# Altium schematic sheet node MCU.SchDoc
size A; SheetNumber: 1; SheetTotal: 1
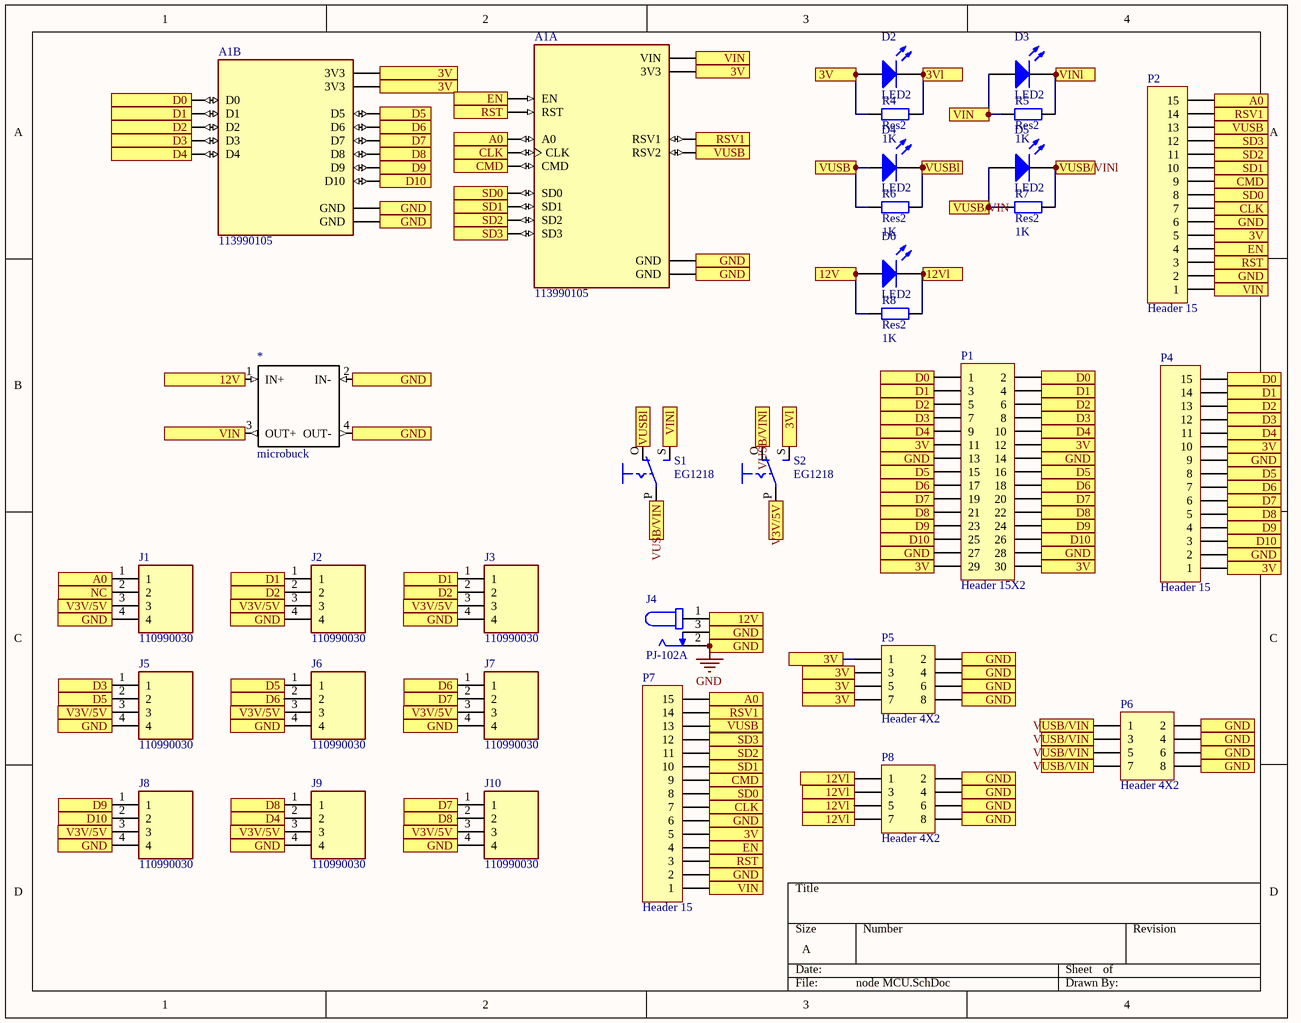
[diagram p0: node MCU.SchDoc]

## Parts
*  microbuck  [Micro buck]
A1  113990105  [SEEED_113990105]  (parts A,B of 2)
D2  LED2  [3.2X1.6X1.1]
D3  LED2  [3.2X1.6X1.1]
D4  LED2  [3.2X1.6X1.1]
D5  LED2  [3.2X1.6X1.1]
D6  LED2  [3.2X1.6X1.1]
J1  110990030  [SEEED_110990030]
J2  110990030  [SEEED_110990030]
J3  110990030  [SEEED_110990030]
J4  PJ-102A  [CUI_PJ-102A]
J5  110990030  [SEEED_110990030]
J6  110990030  [SEEED_110990030]
J7  110990030  [SEEED_110990030]
J8  110990030  [SEEED_110990030]
J9  110990030  [SEEED_110990030]
J10  110990030  [SEEED_110990030]
P1  Header 15X2  [HDR2X15]
P2  Header 15  [HDR1X15]
P4  Header 15  [HDR1X15]
P5  Header 4X2  [HDR2X4]
P6  Header 4X2  [HDR2X4]
P7  Header 15  [HDR1X15]
P8  Header 4X2  [HDR2X4]
R4  Res2  value 1K  [AXIAL-0.4]
R5  Res2  value 1K  [AXIAL-0.4]
R6  Res2  value 1K  [AXIAL-0.4]
R7  Res2  value 1K  [AXIAL-0.4]
R8  Res2  value 1K  [AXIAL-0.4]
S1  EG1218  [EG1218]
S2  EG1218  [EG1218]

## Ports
3V, 3Vl, 12V, 12Vl, A0, CLK, CMD, D0, D1, D2, D3, D4, D5, D6, D7, D8, D9, D10, EN, GND, NC, RST, RSV1, SD0, SD1, SD2, SD3, V3V/5V, VIN, VINl, VUSB, VUSB/VIN, VUSB/VINl, VUSBl

## Nets
GND: *.2(IN-) *.4(OUT-) A1.J1_10(GND) A1.J1_14(GND) A1.J2_7(GND) A1.J2_14(GND) J1.4 J2.4 J3.4 J4.2 J4.3 J5.4 J6.4 J7.4 J8.4 J9.4 J10.4 P1.13 P1.14 P1.27 P1.28 P2.2 P2.6 P4.2 P4.9 P5.2 P5.4 P5.6 P5.8 P6.2 P6.4 P6.6 P6.8 P7.2 P7.6 P8.2 P8.4 P8.6 P8.8 ; port GND
3V: A1.J1_11(3V3) A1.J2_6(3V3) A1.J2_15(3V3) D2.1(A) P1.11 P1.12 P1.29 P1.30 P2.5 P4.1 P4.10 P5.1 P5.3 P5.5 P5.7 P7.5 R4.1 ; port 3V
3Vl: D2.2(K) R4.2 S2.S ; port 3Vl
12V: *.1(IN+) D6.1(A) J4.1 R8.1 ; port 12V
12Vl: D6.2(K) P8.1 P8.3 P8.5 P8.7 R8.2 ; port 12Vl
A0: A1.J1_1(A0) J1.1 P2.15 P7.15 ; port A0
CLK: A1.J1_9(CLK) P2.7 P7.7 ; port CLK
CMD: A1.J1_7(CMD) P2.9 P7.9 ; port CMD
D0: A1.J2_1(D0) P1.1 P1.2 P4.15 ; port D0
D1: A1.J2_2(D1) J2.1 J3.1 P1.3 P1.4 P4.14 ; port D1
D2: A1.J2_3(D2) J2.2 J3.2 P1.5 P1.6 P4.13 ; port D2
D3: A1.J2_4(D3) J5.1 P1.7 P1.8 P4.12 ; port D3
D4: A1.J2_5(D4) J9.2 P1.9 P1.10 P4.11 ; port D4
D5: A1.J2_8(D5) J5.2 J6.1 P1.15 P1.16 P4.8 ; port D5
D6: A1.J2_9(D6) J6.2 J7.1 P1.17 P1.18 P4.7 ; port D6
D7: A1.J2_10(D7) J7.2 J10.1 P1.19 P1.20 P4.6 ; port D7
D8: A1.J2_11(D8) J9.1 J10.2 P1.21 P1.22 P4.5 ; port D8
D9: A1.J2_12(D9) J8.1 P1.23 P1.24 P4.4 ; port D9
D10: A1.J2_13(D10) J8.2 P1.25 P1.26 P4.3 ; port D10
EN: A1.J1_12(EN) P2.4 P7.4 ; port EN
NC: J1.2 ; port NC
RST: A1.J1_13(RST) P2.3 P7.3 ; port RST
RSV1: A1.J1_2(RSV1) P2.14 P7.14 ; port RSV1
SD0: A1.J1_8(SD0) P2.8 P7.8 ; port SD0
SD1: A1.J1_6(SD1) P2.10 P7.10 ; port SD1
SD2: A1.J1_5(SD2) P2.11 P7.11 ; port SD2
SD3: A1.J1_4(SD3) P2.12 P7.12 ; port SD3
V3V/5V: J1.3 J2.3 J3.3 J5.3 J6.3 J7.3 J8.3 J9.3 J10.3 S2.P ; port V3V/5V
VIN: *.3(OUT+) A1.J1_15(VIN) D3.1(A) P2.1 P7.1 R5.1 ; port VIN
VINl: D3.2(K) R5.2 S1.S ; port VINl
VUSB: A1.J1_3(RSV2) D4.1(A) P2.13 P7.13 R6.1 ; port VUSB
VUSB/VIN: D5.1(A) P6.1 P6.3 P6.5 P6.7 R7.1 S1.P ; port VUSB/VIN
VUSB/VINl: D5.2(K) R7.2 S2.O ; port VUSB/VINl
VUSBl: D4.2(K) R6.2 S1.O ; port VUSBl

## Library data of the parts
A1 = 113990105: - ESP8266 Transceiver; 802.11 b/g (Wi-Fi, WiFi, WLAN) 2.4GHz Evaluation Board; MF: Seeed Technology Co., Ltd; Price: None; Availability: In Stock; MP: 113990105; Package: None; SnapEDA_Link: https://www.snapeda.com/parts/113990105/Seeed+Technology+Co.%252C+Ltd/view-part/?ref=snap; Check_prices: https://www.snapeda.com/parts/113990105/Seeed+Technology+Co.%252C+Ltd/view-part/?ref=eda; Value: *; Purchase-URL: https://pricing.snapeda.com/search/part/113990105/?ref=eda
D2-D6 = LED2: Typical RED, GREEN, YELLOW, AMBER GaAs LED; Published: 8-Jun-2000; LatestRevisionDate: 17-Jul-2002; LatestRevisionNote: Re-released for DXP Platform.; PackageVersion: Feb-2002; PackageReference: 3.2X1.6X1.1; Publisher: Altium Limited; PackageDescription: SM LED; 2 Flat Leads
J1-J3 J5-J10 = 110990030: GROVE 2MM 4PIN VERT CONN 10PCS; MF: Seeed Technology; Arrow_Electronics-Purchase-URL: https://snapeda.com/shop?store=Arrow+Electronics&id=583576; Availability: Good; Package: None; Price: None; Mouser-Purchase-URL: https://snapeda.com/shop?store=Mouser&id=583576; MP: 110990030; SnapEDA_Link: https://www.snapeda.com/parts/110990030/Seeed%20Technology%20Co.,%20Ltd/view-part/583576/?ref=snap; Value: *
J4 = PJ-102A: 2.0 x 6.5 mm, 2.5 A, Horizontal, Through Hole, Tapered Pins, Dc Power Jack Connector; MF: CUI Devices; Price: None; Availability: In Stock; Package: None; MP: PJ-102A; CUI_purchase_URL: https://www.cuidevices.com/product/interconnect/connectors/dc-power-connectors/jacks/pj-102a?utm_source=snapeda.com&utm_medium=referral&utm_campaign=snapedaBOM; Value: *; SnapEDA_Link: https://www.snapeda.com/parts/PJ-102A/CUI+Devices/view-part/?ref=snap; Purchase-URL: https://pricing.snapeda.com/search/part/PJ-102A/?ref=eda; Check_prices: https://www.snapeda.com/parts/PJ-102A/CUI+Devices/view-part/?ref=eda
P1 = Header 15X2: Header, 15-Pin, Dual row; LatestRevisionDate: 17-Jul-2002; LatestRevisionNote: Re-released for DXP Platform.; Publisher: Altium Limited
P2 P4 P7 = Header 15: Header, 15-Pin; LatestRevisionDate: 17-Jul-2002; LatestRevisionNote: Re-released for DXP Platform.; Publisher: Altium Limited
P5 P6 P8 = Header 4X2: Header, 4-Pin, Dual row; LatestRevisionDate: 17-Jul-2002; LatestRevisionNote: Re-released for DXP Platform.; Publisher: Altium Limited
R4-R8 = Res2: Resistor; Published: 8-Jun-2000; LatestRevisionDate: 17-Jul-2002; LatestRevisionNote: Re-released for DXP Platform.; PackageReference: AXIAL-0.4; Publisher: Altium Limited; PackageDescription: Axial Device, Thru-Hole; 2 Leads; 0.4 in Pin Spacing
S1 S2 = EG1218: Slide Switch SPDT Through Hole; MF: E-Switch; Purchase-URL: https://pricing.snapeda.com/search/part/EG1218/?ref=eda; Package: None; Availability: In Stock; MP: EG1218; Value: *; Check_prices: https://www.snapeda.com/parts/EG1218/E-Switch/view-part/?ref=eda; SnapEDA_Link: https://www.snapeda.com/parts/EG1218/E-Switch/view-part/?ref=snap; Price: None